# EAGLE design MAX31855T (EAGLE 7.2.0)
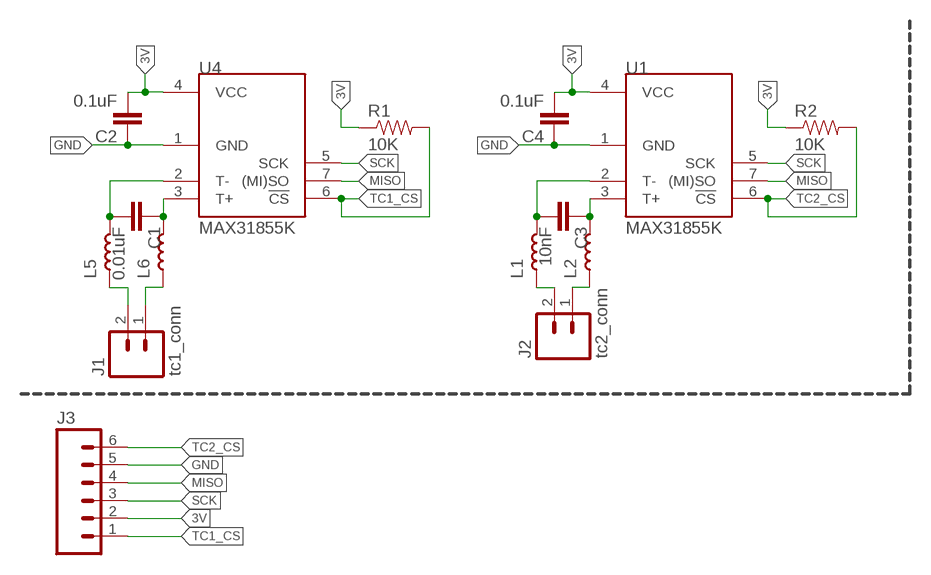
[diagram p0: schematic, sheet 1]

## Parts
C1  0.01uF  10NF/10000PF-50V-10%(0603)  [0603-CAP]
C2  0.1uF  0.1UF-25V(+80/-20%)(0603)  [0603-CAP]
C3  10nF  10NF/10000PF-50V-10%(0603)  [0603-CAP]
C4  0.1uF  0.1UF-25V(+80/-20%)(0603)  [0603-CAP]
J1  tc1_conn  M02PTH3  [1X02_LONGPADS]
J2  tc2_conn  M02PTH3  [1X02_LONGPADS]
J3  M06LONGPADS  [1X06_LONGPADS]
L1  INDUCTOR0603-N  [L0603-N]
L2  INDUCTOR0603-N  [L0603-N]
L5  INDUCTOR0603-N  [L0603-N]
L6  INDUCTOR0603-N  [L0603-N]
R1  10K  10KOHM-1/10W-1%(0603)0603  [0603-RES]
R2  10K  10KOHM-1/10W-1%(0603)0603  [0603-RES]
U1  MAX31855K  [SOIC8]
U4  MAX31855K  [SOIC8]

## Nets
3V: C2.2 C4.2 J3.2 R1.1 R2.1 U1.4(VCC) U4.4(VCC)
GND: C2.1 C4.1 J3.5 U1.1(GND) U4.1(GND)
MISO: J3.4 U1.7((MI)SO) U4.7((MI)SO)
N$1: C3.2 L1.2 U1.2(T-)
N$2: C3.1 L2.2 U1.3(T+)
N$3: J1.1 L6.1
N$4: J1.2 L5.1
N$5: J2.1 L2.1
N$6: C1.2 L5.2 U4.2(T-)
N$7: C1.1 L6.2 U4.3(T+)
N$8: J2.2 L1.1
SCK: J3.3 U1.5(SCK) U4.5(SCK)
TC1_CS: J3.1 R1.2 U4.6(!CS)
TC2_CS: J3.6 R2.2 U1.6(!CS)

## Library data of the parts
C1 = SparkFun_Thermocouple_Breakout:10NF/10000PF-50V-10%(0603): CAP-00867; PROD_ID: CAP-00867; VALUE: 10nF
C2 C4 = SparkFun_Thermocouple_Breakout:0.1UF-25V(+80/-20%)(0603): CAP-00810 Ceramic Standard decoupling cap; PROD_ID: CAP-00810
C3 = SparkFun_Thermocouple_Breakout:10NF/10000PF-50V-10%(0603): CAP-00867; PROD_ID: CAP-00867
J1 J2 = SparkFun-Connectors:M02: Standard 2-pin 0.1" header. Use with - straight break away headers ( PRT-00116) - right angle break away headers (PRT-00553) - swiss pins (PRT-00743) - machine pins (PRT-00117) - female headers (PRT-00115) Molex polarized connector foot print use with: PRT-08233 with associated crimp pins and housings. 2.54_SCREWTERM for use with PRT-10571. 3.5mm Screw Terminal footprints for PRT-08084 5mm Screw Terminal footprints for use with PRT-08432
J3 = SparkFun-Connectors:M06: Header 6 Standard 6-pin 0.1" header. Use with straight break away headers (SKU : PRT-00116), right angle break away headers (PRT-00553), swiss pins (PRT-00743), machine pins (PRT-00117), and female headers (PRT-00115). Molex polarized connector foot print use with SKU : PRT-08094 with associated crimp pins and housings. NOTES ON THE VARIANTS LOCK and LOCK_LONGPADS... This footprint was designed to help hold the alignment of a through-hole component (i.e. 6-pin header) while soldering it into place. You may notice that each hole has been shifted either up or down by 0.005 of an inch from it's more standard position (which is a perfectly straight line). This slight alteration caused the pins (the squares in the middle) to touch the edges of the holes. Because they are alternating, it causes a "brace" to hold the component in place. 0.005 has proven to be the perfect amount of "off-center" position when using our standard breakaway headers. Although looks a little odd when you look at the bare footprint, once you have a header in there, the alteration is very hard to notice. Also,if you push a header all the way into place, it is covered up entirely on the bottom side. This idea of altering the position of holes to aid alignment will be further integrated into the Sparkfun Library for other footprints. It can help hold any component with 3 or more connection pins.
L1 L2 L5 L6 = passives-7351:INDUCTOR
R1 R2 = SparkFun_Thermocouple_Breakout:10KOHM-1/10W-1%(0603): RES-00824; PROD_ID: RES-00824
U1 U4 = SparkFun_Thermocouple_Breakout:MAX31855K: Cold-Junction-Compensated K-Thermocoupleto-Digital Converter (-270°C to +1800°C) The MAX31855K performs cold-junction compensation and digitizes the signal from a type-K thermocouple. The data is output in a 14-bit resolution, SPI™-compatible, read-only format. This converter resolves temperatures to 0.25°C, allows readings as high as +1800°C and as low as -270°C, and exhibits thermocouple accuracy of ±2°C for temperatures ranging from -200°C to +700°C for K-type thermocouples.

## Board
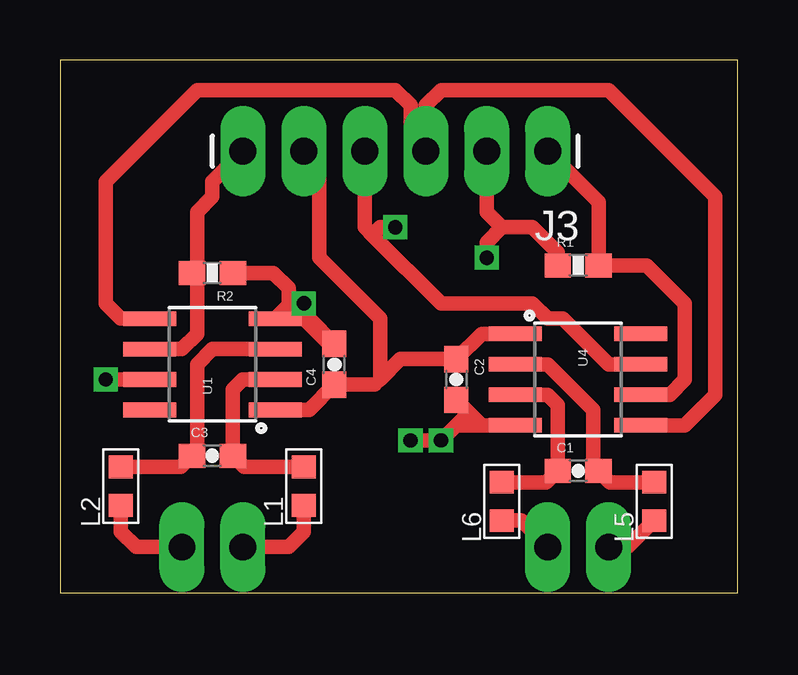
[diagram p1: board, top side]
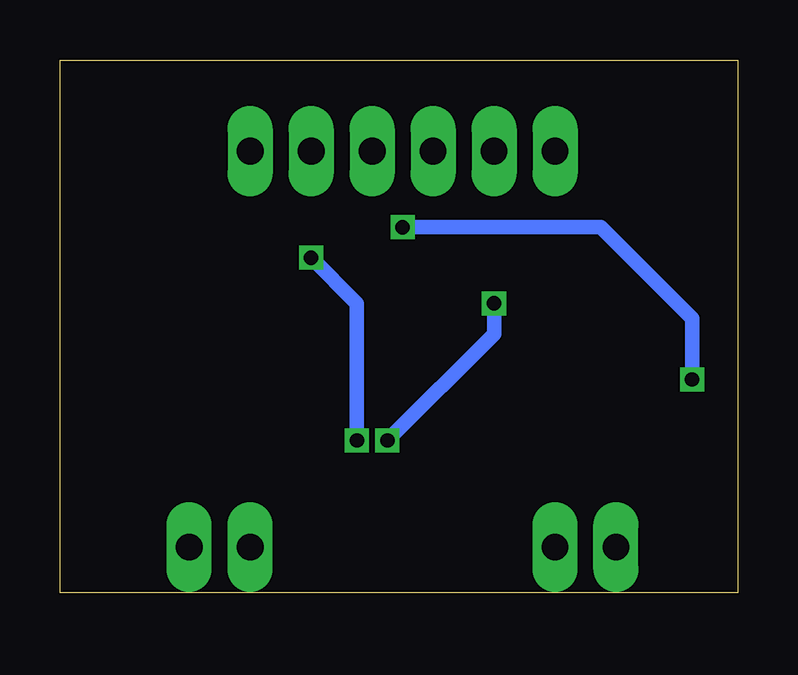
[diagram p2: board, bottom side, seen from below]

Size 28.25 x 22.21 mm. Coordinates in mm from the lower left corner, seen from the top.
Outline: 0,0 28.25,0 28.25,22.21 0,22.21 0,0
Copper layers (1*16): Top 0.035mm / dielectric 1.5mm / Bottom 0.035mm
Design rules "default": minimum track width 10mil, minimum drill 24mil, track to track 8mil, track to pad 8mil, pad to pad 8mil, via to via 8mil, smd to smd 8mil, copper to edge 40mil, drill to drill 8mil, minimum pad ring 10mil, minimum via ring 8mil, stop-mask expansion 4mil, vias tented up to drill 0mil, thermal gap 10mil

### Footprints (pad centres in the part's own frame; a part is rotated, then mirrored left to right if it is on the bottom)
0603-CAP = smd 1.1 x 1: 1 -0.85,0; 2 0.85,0
1X02_LONGPADS = drill 1.118 pad 1.88 long: 1 0,0; 2 2.54,0
1X06_LONGPADS = drill 1.118 pad 1.88 long: 1 0,0; 2 2.54,0; 3 5.08,0; 4 7.62,0; 5 10.16,0; 6 12.7,0
L0603-N = smd 0.95 x 1: 1 -0.8,0; 2 0.8,0
0603-RES = smd 1.1 x 1: 1 -0.85,0; 2 0.85,0
SOIC8 = smd 0.61 x 2.21: 1 -1.905,-2.616; 2 -0.635,-2.616; 3 0.635,-2.616; 4 1.905,-2.616; 5 1.905,2.616; 6 0.635,2.616; 7 -0.635,2.616; 8 -1.905,2.616

### Placement (x,y rotation side)
C1  21.59,5.08 0 top
C2  16.51,8.89 270 top
C3  6.35,5.71 0 top
C4  11.43,9.53 90 top
J1  20.32,1.91 0 top
J2  5.08,1.91 0 top
J3  20.32,18.41 180 top
L1  10.16,4.45 90 top
L2  2.54,4.45 90 top
L5  24.77,3.81 90 top
L6  18.41,3.81 90 top
R1  21.59,13.65 0 top
R2  6.35,13.34 180 top
U1  6.35,9.53 90 top
U4  21.59,8.89 270 top

### Tracks (layer width: path | path; a pad name or v marks a point on that pad's centre or on a via)
3V  (via drill 0.6)
  Top 0.61: R2.1 8.89,13.34 9.53,12.7 9.53,11.99 U1.4 10.16,11.43 | 10.16,11.43 10.38,11.43 C4.2 11.21,10.38 10.16,11.43 | 17.04,7.51 17.57,6.99 U4.4 16.51,6.99 | 17.04,7.51 C2.2 | R1.1 20.74,14.19 19.68,15.24 18.41,15.24 | 18.41,15.24 17.78,15.88 J3.2 | 10.16,11.43 v10.16,12.06 | v14.61,6.35 v15.88,6.35 16.51,6.99 | 16.51,6.99 17.04,7.51 | v17.78,13.97 17.78,14.61 18.41,15.24
  Bottom 0.61: v10.16,12.06 10.16,10.79 v14.61,6.35 | v15.88,6.35 15.88,12.06 v17.78,13.97
GND
  Top 0.61: U1.1 10.38,7.62 C4.1 13.12,8.68 13.34,8.89 | 13.34,8.89 13.34,11.43 10.79,13.97 10.79,17.78 J3.5 | 13.34,8.89 14.19,9.74 C2.1 17.57,10.79 U4.1
MISO  (via drill 0.6)
  Top 0.61: U4.7 22.86,9.53 20.95,11.43 20.32,11.43 19.68,12.06 15.88,12.06 13.02,14.92 | 13.02,14.92 12.7,15.24 J3.4 | U1.7 v1.91,8.89 | v13.97,15.24 13.34,15.24 13.02,14.92
  Bottom 0.61: v13.97,15.24 5.71,15.24 1.91,11.43 v1.91,8.89
N$1
  Top 0.61: L1.2 7.67,5.25 C3.2 7.2,8.47 7.62,8.89 U1.2
N$2
  Top 0.61: L2.2 5.03,5.25 C3.1 5.71,5.93 5.71,9.53 6.35,10.16 U1.3
N$3
  Top 0.61: L6.1 19.21,3.01 J1.1
N$4
  Top 0.61: J1.2 23.66,1.91 L5.1
N$5
  Top 0.61: J2.1 3.17,1.91 2.54,2.54 L2.1
N$6
  Top 0.61: U4.2 20.32,9.53 22.23,7.62 22.23,5.29 C1.2 22.91,4.61 L5.2
N$7
  Top 0.61: U4.3 20.32,8.26 20.74,7.83 C1.1 20.27,4.61 L6.2
N$8
  Top 0.61: J2.2 9.53,1.91 10.16,2.54 L1.1
SCK
  Top 0.61: U1.5 2.54,11.43 1.91,12.06 1.91,17.14 5.71,20.95 13.97,20.95 14.61,20.32 14.61,19.05 J3.3 15.24,20.32 15.88,20.95 22.86,20.95 27.3,16.51 27.3,8.26 26.04,6.99 U4.5
TC1_CS
  Top 0.61: J3.1 22.44,16.3 R1.2 24.45,13.65 26.04,12.06 26.04,8.89 25.4,8.26 U4.6
TC2_CS
  Top 0.61: U1.6 5.08,10.16 5.71,10.79 5.71,13.12 | 5.71,13.12 R2.2 | 5.71,13.12 5.71,15.88 6.35,16.51 6.35,17.14 J3.6